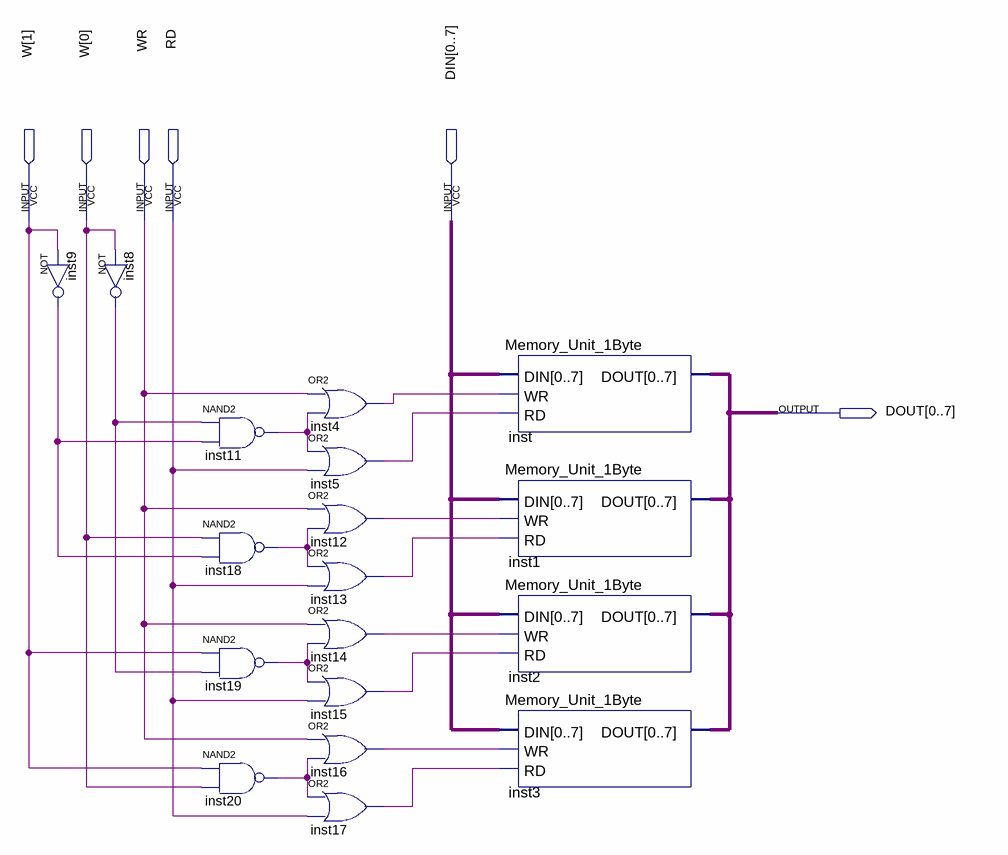
[diagram p0: schematic sheet]
// Quartus schematic Memory_Unit_1Block.bdf as structural Verilog: 18 symbols, 6 pins
module Memory_Unit_1Block (
  input  [1:0] W,
  input  WR,
  input  RD,
  input  [0:7] DIN,
  output [0:7] DOUT
);

  wire inst4_out, inst5_out, inst8_out, inst9_out, inst11_out, inst12_out, inst13_out, inst14_out,
       inst15_out, inst16_out, inst17_out, inst18_out, inst19_out, inst20_out;

  not inst9 (inst9_out, W[1]);
  not inst8 (inst8_out, W[0]);
  nand inst11 (inst11_out, inst8_out, inst9_out);
  nand inst18 (inst18_out, W[0], inst9_out);
  nand inst19 (inst19_out, W[1], inst8_out);
  nand inst20 (inst20_out, W[1], W[0]);
  or inst4 (inst4_out, WR, inst11_out);
  or inst5 (inst5_out, inst11_out, RD);
  or inst12 (inst12_out, WR, inst18_out);
  or inst13 (inst13_out, inst18_out, RD);
  or inst14 (inst14_out, WR, inst19_out);
  or inst15 (inst15_out, inst19_out, RD);
  or inst16 (inst16_out, WR, inst20_out);
  or inst17 (inst17_out, inst20_out, RD);
  Memory_Unit_1Byte inst (.DIN(DIN), .WR(inst4_out), .RD(inst5_out), .DOUT(DOUT));
  Memory_Unit_1Byte inst1 (.DIN(DIN), .WR(inst12_out), .RD(inst13_out), .DOUT(DOUT));
  Memory_Unit_1Byte inst2 (.DIN(DIN), .WR(inst14_out), .RD(inst15_out), .DOUT(DOUT));
  Memory_Unit_1Byte inst3 (.DIN(DIN), .WR(inst16_out), .RD(inst17_out), .DOUT(DOUT));
endmodule
